# Altium schematic sheet CAN.SchDoc
size A; SheetNumber: 5; SheetTotal: 5
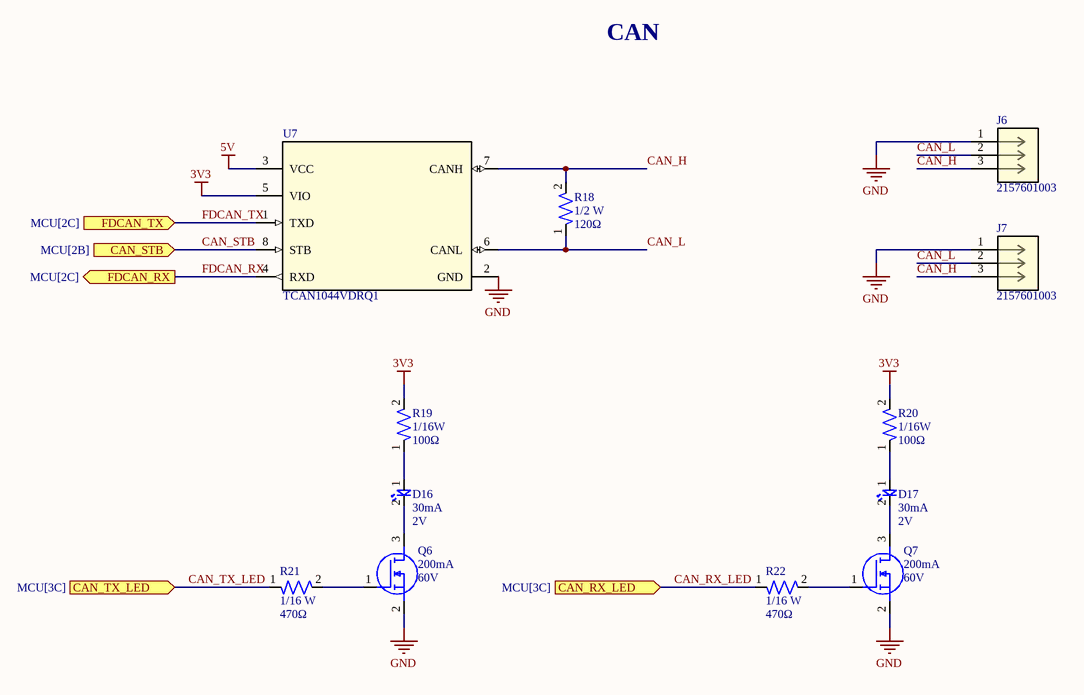
[diagram p0: CAN.SchDoc]

## Parts
D16  Forward Current: 30mA  Forward Voltage: 2V  [LED-0603]  (hidden comment: BL-HKC36G-AV-TRB)
D17  Forward Current: 30mA  Forward Voltage: 2V  [LED-0603]  (hidden comment: BL-HKC36G-AV-TRB)
J6  2157601003  [CONN_2157600003-SD_03_PEG_MOL]
J7  2157601003  [CONN_2157600003-SD_03_PEG_MOL]
Q6  Continuous Current: 200mA  Voltage: 60V  [IC-SOT23-3]  (hidden comment: T2N7002AK,LM)
Q7  Continuous Current: 200mA  Voltage: 60V  [IC-SOT23-3]  (hidden comment: T2N7002AK,LM)
R18  Wattage: 1/2 W  Resistance: 120Ω  [RES-1210]  (hidden comment: RC1210FR-07120RL)
R19  Wattage: 1/16W  Resistance: 100Ω  [RES-0805]  (hidden comment: RES 0805)
R20  Wattage: 1/16W  Resistance: 100Ω  [RES-0805]  (hidden comment: RES 0805)
R21  Wattage: 1/16 W  Resistance: 470Ω  [RES-0805]  (hidden comment: RES 0805)
R22  Wattage: 1/16 W  Resistance: 470Ω  [RES-0805]  (hidden comment: RES 0805)
U7  TCAN1044VDRQ1  [IC-8SOIC]

## Ports
CAN_RX_LED (in, see MCU[3C]), CAN_STB (in, see MCU[2B]), CAN_TX_LED (in, see MCU[3C]), FDCAN_RX (out, see MCU[2C]), FDCAN_TX (in, see MCU[2C])

## Nets
3V3: R19.2 R20.2 U7.5(VIO)
5V: U7.3(VCC)
GND: J6.1 J7.1 Q6.2(S) Q7.2(S) U7.2(GND)
CAN_H: J6.3 J7.3 R18.2 U7.7(CANH)
CAN_L: J6.2 J7.2 R18.1 U7.6(CANL)
CAN_RX_LED: R22.1 ; port CAN_RX_LED
CAN_STB: U7.8(STB) ; port CAN_STB
CAN_TX_LED: R21.1 ; port CAN_TX_LED
FDCAN_RX: U7.4(RXD) ; port FDCAN_RX
FDCAN_TX: U7.1(TXD) ; port FDCAN_TX
NetD16_1: D16.1 R19.1
NetD16_2: D16.2 Q6.3(D)
NetD17_1: D17.1 R20.1
NetD17_2: D17.2 Q7.3(D)
NetQ6_1: Q6.1(G) R21.2
NetQ7_1: Q7.1(G) R22.2

## Notes on the sheet
- CAN

## Library data of the parts
D16 D17 = LED-0001: LED YELLOW CLEAR 0603 SMD; ComponentLink1Description: Datasheet; ComponentLink1URL: https://www.americanbrightled.com/pdffiles/led-components/smt/BL-HKC36G-AV-TRB.pdf
J6 J7 = CONN MF+ 3 PIN Right Angle: Micro-Fit+ Right-Angle Header, Through Hole, 3.00mm Pitch, Single Row, 3  Circuits, Matte Tin (Sn) Plating, Glow-Wire Capable, Black; Manufacturer_Name: Molex; Copyright: Copyright (C) 2026 Ultra Librarian. All rights reserved.; Manufacturer_Part_Number: 2157601003; Datasheet: https://www.molex.com/en-us/products/part-detail-pdf/2157601003?display=pdf; RefDes: RefDes; Type: Type
Q6 Q7 = NMOS-200MA-0001: MOSFET N-CH 60V 200MA SOT23; ComponentLink1Description: Datasheet; ComponentLink1URL: https://toshiba.semicon-storage.com/info/T2N7002AK_datasheet_en_20150401.pdf?did=29712&prodName=T2N7002AK
R18 = RES CAN TERM 1210
U7 = IC-CAN-0001: IC TRANSCEIVER 1/1 8SOIC; ComponentLink1Description: Datasheet; ComponentLink1URL: https://www.ti.com/lit/ds/symlink/tcan1044-q1.pdf?HQS=dis-dk-null-digikeymode-dsf-pf-null-wwe&ts=1728758303289&ref_url=https%253A%252F%252Fwww.ti.com%252Fgeneral%252Fdocs%252Fsuppproductinfo.tsp%253FdistId%253D10%2526gotoUrl%253Dhttps%253A%252F%252Fwww.ti.com%252Flit%252Fgpn%252Ftcan1044-q1